# EAGLE design dispenser_7.7 (EAGLE 7.7.0)
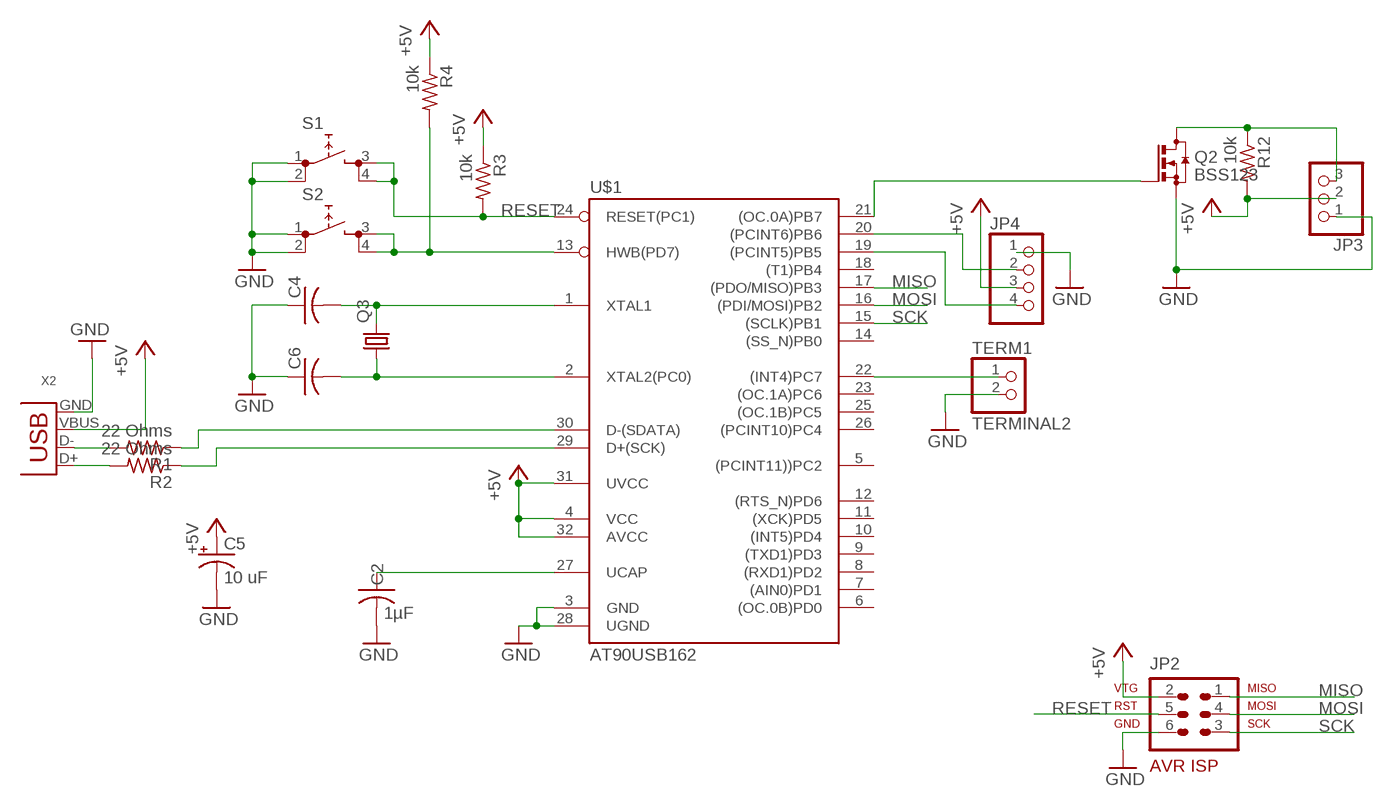
[diagram p0: schematic, sheet 1]

## Parts
C2  1µF  C-USC050-025X075  [C050-025X075]
C4  C-USC050-025X075  [C050-025X075]
C5  10 uF  CPOL-USE2.5-5  [E2,5-5]
C6  C-USC050-025X075  [C050-025X075]
JP2  AVR-ISP-6  [AVR-ISP-6]
JP3  PINHD-1X3  [1X03]
JP4  PINHD-1X4  [1X04]
Q2  BSS123  [SOT23]
Q3  CRYSTALHC49S  [HC49/S]
R1  22 Ohms  R-US_0207/7  [0207/7]
R2  22 Ohms  R-US_0207/7  [0207/7]
R3  10k  R-US_0207/7  [0207/7]
R4  10k  R-US_0207/7  [0207/7]
R12  10k  R-US_0207/7  [0207/7]
S1  PUSHBUTTON  [TL1105SP]
S2  PUSHBUTTON  [TL1105SP]
TERM1  TERMINAL2  [TERM2]
U$1  AT90USB162  [TQFP32-08]
X2  USB-MB-H  [USB-MB-H]

## Nets
+5V: C5.+ JP2.2 JP3.2 JP4.3 R3.1 R4.1 R12.2 U$1.4(VCC) U$1.31(UVCC) U$1.32(AVCC) X2.VBUS
GND: C2.2 C4.1 C5.- C6.1 JP2.6 JP3.1 JP4.1 Q2.2(S) S1.1 S1.2 S2.1 S2.2 TERM1.2 U$1.3(GND) U$1.28(UGND) X2.GND
MISO: JP2.1 U$1.17((PDO/MISO)PB3)
MOSI: JP2.4 U$1.16((PDI/MOSI)PB2)
N$1: JP4.4 U$1.19((PCINT5)PB5)
N$2: JP4.2 U$1.20((PCINT6)PB6)
N$3: C4.2 Q3.2 U$1.1(XTAL1)
N$4: Q2.1(G) U$1.21((OC.0A)PB7)
N$5: C6.2 Q3.1 U$1.2(XTAL2(PC0))
N$6: R2.1 U$1.29(D+(SCK))
N$7: TERM1.1 U$1.22((INT4)PC7)
N$8: R2.2 X2.D+
N$9: R1.2 X2.D-
N$10: C2.1 U$1.27(UCAP)
N$11: R1.1 U$1.30(D-(SDATA))
N$13: R4.2 S2.3 S2.4 U$1.13(HWB(PD7))
N$18: JP3.3 Q2.3(D) R12.1
RESET: JP2.5 R3.2 S1.3 S1.4 U$1.24(RESET(PC1))
SCK: JP2.3 U$1.15((SCLK)PB1)
Unconnected: U$1.5((PCINT11))PC2) U$1.6((OC.0B)PD0) U$1.7((AIN0)PD1) U$1.8((RXD1)PD2) U$1.9((TXD1)PD3) U$1.10((INT5)PD4) U$1.11((XCK)PD5) U$1.12((RTS_N)PD6) U$1.14((SS_N)PB0) U$1.18((T1)PB4) U$1.23((OC.1A)PC6) U$1.25((OC.1B)PC5) U$1.26((PCINT10)PC4)

## Library data of the parts
C2 C4 C6 = cphe380:C-US: CAPACITOR, American symbol
C5 = rcl@1:CPOL-US: POLARIZED CAPACITOR, American symbol; SPICEPREFIX: C
JP2 = avr-tsh:AVR-ISP-6: AVR ISP-6 Serial Programming Header
JP3 = pinhead@1:PINHD-1X3: PIN HEADER
JP4 = pinhead:PINHD-1X4: PIN HEADER
Q2 = transistor-small-signal:BSS123: N-CHANNEL MOS FET
Q3 = crystal:CRYSTAL: CRYSTAL; OC_FARNELL: 1667008; OC_NEWARK: unknown
R1 R2 = rcl@1:R-US_: RESISTOR, American symbol; SPICEPREFIX: R
R3 R4 R12 = rcl:R-US_: RESISTOR, American symbol
S1 S2 = cphe380:PUSHBUTTON: PUSHBUTTON SWITCH Tactile Switch
TERM1 = tsh:TERMINAL2: Terminal Block Jameco #189676 Manufacturer: OST Part #EDC500/2DS
U$1 = avr-tsh:AT90USB162
X2 = con-usb-3:USB: USB Connectors

## Board
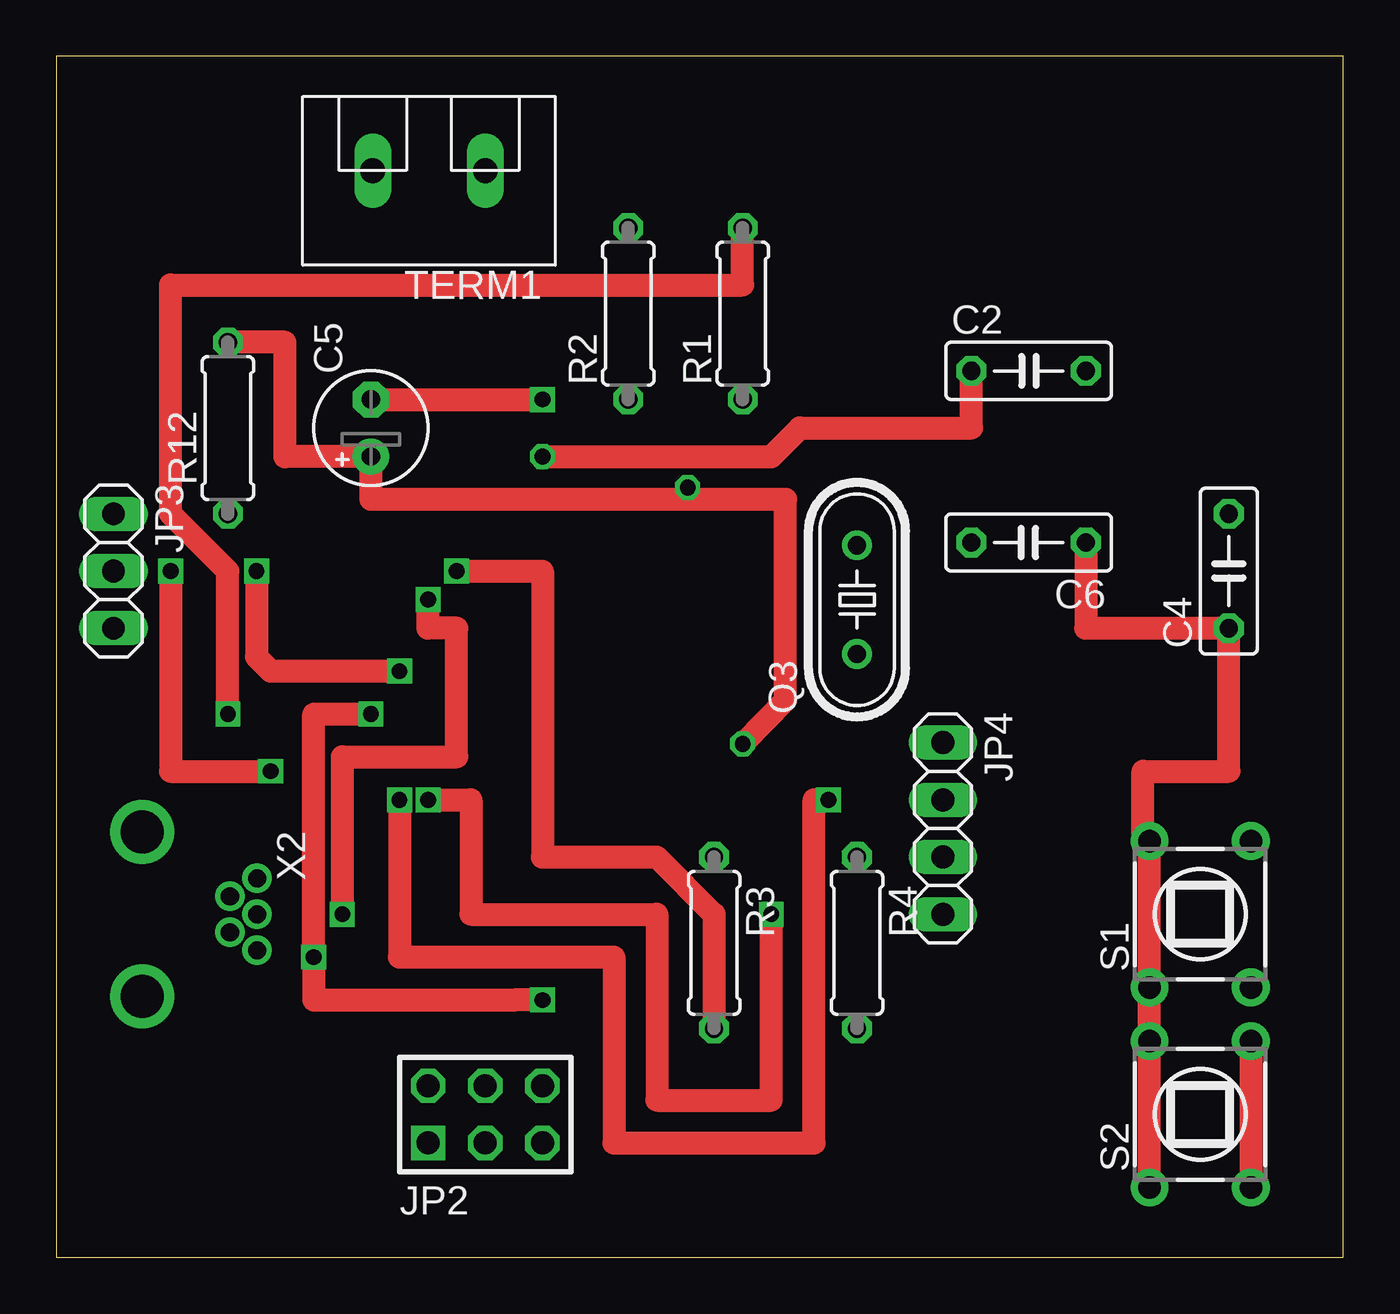
[diagram p1: board, top side]
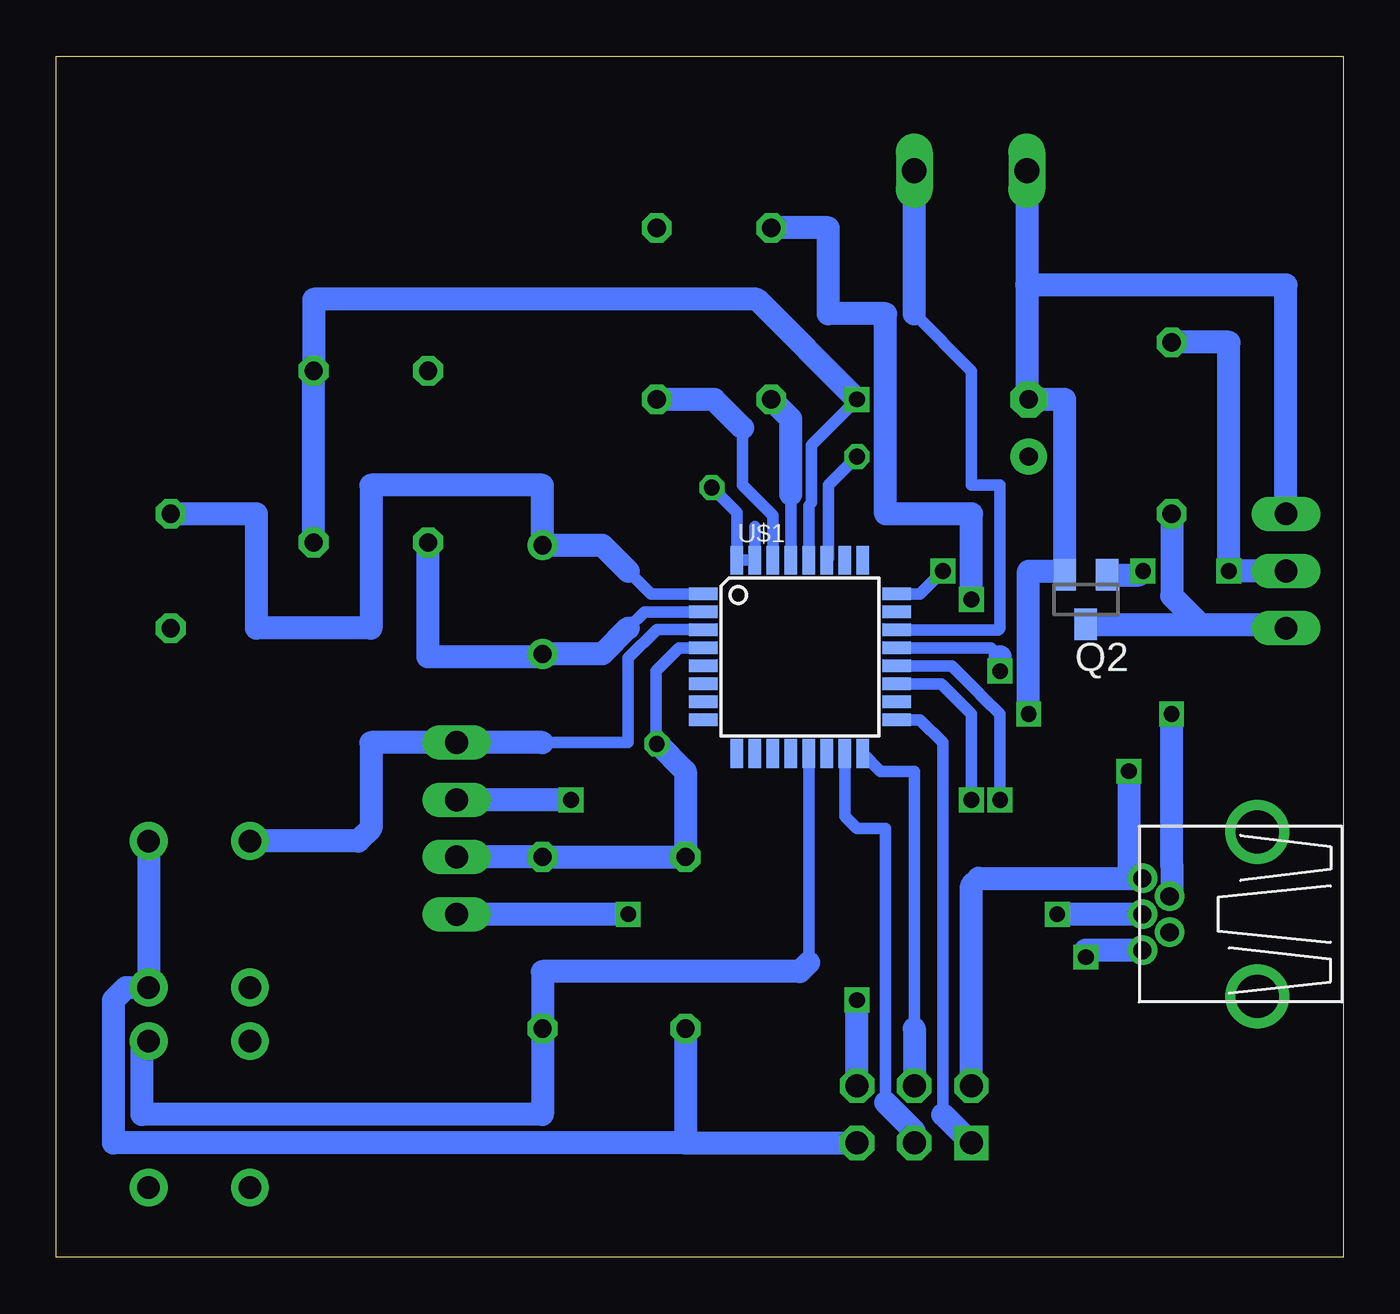
[diagram p2: board, bottom side, seen from below]

Size 57.15 x 53.34 mm. Coordinates in mm from the lower left corner, seen from the top.
Outline: 0,0 57.15,0 57.15,53.34 0,53.34 0,0
Copper layers (1*16): Top 0.035mm / dielectric 1.5mm / Bottom 0.035mm
Design rules "default": minimum track width 6mil, minimum drill 0.35mm, track to track 6mil, track to pad 6mil, pad to pad 6mil, via to via 6mil, smd to smd 6mil, copper to edge 40mil, drill to drill 6mil, minimum pad ring 10mil, minimum via ring 8mil, stop-mask expansion 4mil, vias tented up to drill 0mil, thermal gap 10mil

### Footprints (pad centres in the part's own frame; a part is rotated, then mirrored left to right if it is on the bottom)
C050-025X075 = drill 0.813 octagon: 1 -2.54,0; 2 2.54,0
E2,5-5 = drill 0.813 pad 1.6: + -1.27,0 | drill 0.813 pad 1.6 octagon: - 1.27,0
AVR-ISP-6 = drill 1.016 square: 1 -2.54,-1.27 | drill 1.016 octagon: 2 -2.54,1.27; 3 0,-1.27; 4 0,1.27; 5 2.54,-1.27; 6 2.54,1.27
1X03 = drill 1.016 long: 1 -2.54,0; 2 0,0; 3 2.54,0
1X04 = drill 1.016 long: 1 -3.81,0; 2 -1.27,0; 3 1.27,0; 4 3.81,0
SOT23 = smd 1 x 1.4: 1 -0.95,-1.1; 2 0.95,-1.1; 3 0,1.1
HC49/S = drill 0.813: 1 -2.413,0; 2 2.413,0
0207/7 = drill 0.813 octagon: 1 -3.81,0; 2 3.81,0
TL1105SP = drill 1 pad 1.676: 1 -2.25,-3.25; 2 -2.25,3.25; 3 2.25,-3.25; 4 2.25,3.25
TERM2 = drill 1.1 long: 1 0,0; 2 5,0
TQFP32-08 = smd 1.27 x 0.559: 1 -4.293,2.8; 2 -4.293,2; 3 -4.293,1.2; 4 -4.293,0.4; 5 -4.293,-0.4; 6 -4.293,-1.2; 7 -4.293,-2; 8 -4.293,-2.8; 17 4.293,-2.8; 18 4.293,-2; 19 4.293,-1.2; 20 4.293,-0.4; 21 4.293,0.4; 22 4.293,1.2; 23 4.293,2; 24 4.293,2.8 | smd 0.559 x 1.27: 9 -2.8,-4.293; 10 -2,-4.293; 11 -1.2,-4.293; 12 -0.4,-4.293; 13 0.4,-4.293; 14 1.2,-4.293; 15 2,-4.293; 16 2.8,-4.293; 25 2.8,4.293; 26 2,4.293; 27 1.2,4.293; 28 0.4,4.293; 29 -0.4,4.293; 30 -1.2,4.293; 31 -2,4.293; 32 -2.8,4.293
USB-MB-H = drill 0.8: D+ 5.1,0; D- 3.9,0.8; GND 5.1,-1.6; ID 3.9,-0.8; VBUS 5.1,1.6 | drill 1.9: P$6 0,-3.65; P$7 0,3.65

### Placement (x,y rotation side)
C2  43.18,39.37 0 top
C4  52.07,30.48 90 top
C5  13.97,36.83 90 top
C6  43.18,31.75 180 top
JP2  19.05,6.35 0 top
JP3  2.54,30.48 270 top
JP4  39.37,19.05 270 top
Q2  11.43,29.21 180 bottom
Q3  35.56,29.21 90 top
R1  30.48,41.91 90 top
R2  25.4,41.91 90 top
R3  29.21,13.97 270 top
R4  35.56,13.97 270 top
R12  7.62,36.83 90 top
S1  50.8,15.24 0 top
S2  50.8,6.35 0 top
TERM1  19.05,48.26 180 top
U$1  24.13,26.67 0 bottom
X2  3.81,15.24 0 top

### Tracks (layer width: path | path; a pad name or v marks a point on that pad's centre or on a via)
+5V  (via drill 0.7)
  Top 1.016: R12.2 10.16,40.64 10.16,35.56 C5.+ 13.97,33.66 27.94,33.66 | v5.08,30.48 5.08,21.59 v9.53,21.59 | v30.48,22.8 30.54,22.86 32.38,24.77 32.38,33.66 27.94,33.66 | v28.04,34.19 28.04,33.75 27.94,33.66
  Bottom 0.508: 26.13,32.46 U$1.31 U$1.32 26.93,33.08 v28.04,34.19 | 30.48,22.86 v30.48,22.8 30.53,22.85 30.53,26.03 29.49,27.07 U$1.4
  Bottom 1.016: JP3.2 v5.08,30.48 5.08,40.64 R12.2 | JP2.2 16.51,16.51 16.18,16.84 9.53,16.84 | 9.53,16.84 X2.VBUS | 30.48,22.86 29.21,21.59 R3.1 R4.1 JP4.3 | v9.53,21.59 9.53,16.84
GND  (via drill 0.7)
  Top 1.016: C6.1 45.72,27.94 C4.1 52.07,21.59 48.26,21.59 48.26,18.78 S1.2 S1.1 S2.2 S2.1 | C5.- v21.59,38.1 | v21.59,11.43 20.32,11.43 11.43,11.43 v11.43,13.34 11.43,24.13 v13.97,24.13
  Bottom 0.508: v21.59,38.1 23.62,36.07 23.62,33.51 23.73,33.4 U$1.28 | U$1.3 28.44,27.89 30.48,27.89 31.75,26.61 31.75,22.86 35.56,22.86
  Bottom 1.016: C6.1 C2.2 45.72,42.55 26.04,42.55 v21.59,38.1 | TERM1.2 14.05,43.18 | 14.05,43.18 14.05,38.18 C5.- 12.38,38.1 Q2.2 12.55,30.48 13.97,30.48 v13.97,24.13 | 14.05,43.18 2.54,43.18 JP3.1 | JP2.6 v21.59,11.43 | 35.56,22.86 JP4.1 43.18,22.86 43.18,19.05 43.74,18.49 S1.2 | X2.GND 11.43,13.64 v11.43,13.34
MISO
  Bottom 0.508: U$1.17 18.79,23.87 17.78,22.86 17.78,6.35
  Bottom 1.016: JP2.1 17.78,6.35
MOSI
  Bottom 0.508: U$1.16 20.54,21.59 19.05,21.59 19.05,10.16
  Bottom 1.016: 19.05,10.16 JP2.4
N$1  (via drill 0.7)
  Top 1.016: v16.51,20.32 18.41,20.32 18.41,15.24 26.67,15.24 26.67,6.99 31.75,6.99 v31.75,15.24
  Bottom 0.508: U$1.19 17.85,25.47 16.51,24.13 v16.51,20.32
  Bottom 1.016: v31.75,15.24 JP4.4
N$2  (via drill 0.7)
  Top 1.016: v15.24,20.32 15.24,13.34 24.77,13.34 24.77,5.08 33.66,5.08 33.66,20.32 v34.29,20.32
  Bottom 0.508: U$1.20 17.38,26.27 16.15,25.04 16.15,25.02 15.62,24.49 15.6,24.49 15.24,24.13 v15.24,20.32
  Bottom 1.016: v34.29,20.32 JP4.2
N$3
  Bottom 0.508: U$1.1 30.74,29.47 31.75,30.48
  Bottom 1.016: 31.75,30.48 32.89,31.62 Q3.2 35.56,34.29 43.18,34.29 43.18,27.94 48.26,27.94 48.26,33.02 C4.2
N$4  (via drill 0.7)
  Top 1.016: v8.89,30.48 8.89,26.67 9.53,26.04 v15.24,26.04
  Bottom 0.508: 15.24,26.67 15.64,27.07 U$1.21
  Bottom 1.016: Q2.1 9.06,30.31 v8.89,30.48 | 15.24,26.67 v15.24,26.04
N$5
  Bottom 0.508: U$1.2 31.02,28.67 31.75,27.94
  Bottom 1.016: 31.75,27.94 32.89,26.8 Q3.1 35.69,26.67 40.64,26.67 C6.2
N$6
  Bottom 0.508: U$1.29 24.53,33.89
  Bottom 1.016: 24.53,33.89 24.53,37.23 R2.1
N$7
  Bottom 0.508: U$1.22 15.31,27.87 15.24,27.94 15.24,34.29 16.51,34.29 16.51,39.37 19.05,41.91
  Bottom 1.016: 19.05,41.91 TERM1.1
N$8  (via drill 0.7)
  Top 1.016: v12.7,15.24 12.7,22.23 17.78,22.23 17.78,27.94 16.51,27.94 v16.51,29.21
  Bottom 1.016: R2.2 22.86,45.72 22.86,41.91 20.32,41.91 20.32,33.02 16.51,33.02 v16.51,29.21 | X2.D+ v12.7,15.24
N$9  (via drill 0.7)
  Top 1.016: v7.62,24.13 7.62,30.48 5.08,33.02 5.08,43.18 30.48,43.18 R1.2
  Bottom 1.016: v7.62,24.13 7.62,17.41 7.6,17.38 7.6,16.15 X2.D-
N$10  (via drill 0.7)
  Top 1.016: C2.1 40.64,36.83 33.02,36.83 31.75,35.56 v21.59,35.56
  Bottom 0.508: U$1.27 22.86,31.03 22.86,34.29 v21.59,35.56
N$11
  Bottom 0.508: U$1.30 25.33,32.95 26.67,34.29 26.67,36.83
  Bottom 1.016: 26.67,36.83 27.94,38.1 R1.1
N$13
  Top 1.016: S2.4 S2.3
  Bottom 0.508: U$1.13 23.73,13.1
  Bottom 1.016: 23.73,13.1 24.13,12.7 35.56,12.7 R4.2 35.56,6.35 53.34,6.35 53.34,9.31 S2.4
N$18
  Bottom 1.016: Q2.3 6.35,28.11 | 6.35,28.11 2.71,28.11 JP3.3 | R12.1 7.62,29.38 6.35,28.11
RESET  (via drill 0.7)
  Top 1.016: v17.78,30.48 21.59,30.48 21.59,17.78 26.67,17.78 29.21,15.24 R3.2
  Bottom 0.508: U$1.24 18.79,29.47 v17.78,30.48
  Bottom 1.016: R3.2 29.21,5.08 | 29.21,5.08 JP2.5 | 29.21,5.08 54.61,5.08 54.61,11.43 54.05,11.99 S1.3 S1.4
SCK
  Bottom 0.508: 20.32,6.88 20.32,19.05 21.59,19.05 22.13,19.59 U$1.15
  Bottom 1.016: JP2.3 19.05,5.61 20.32,6.88